# Altium schematic sheet 05 CAMERA, HDMI.SchDoc
size 513 x 386 mm
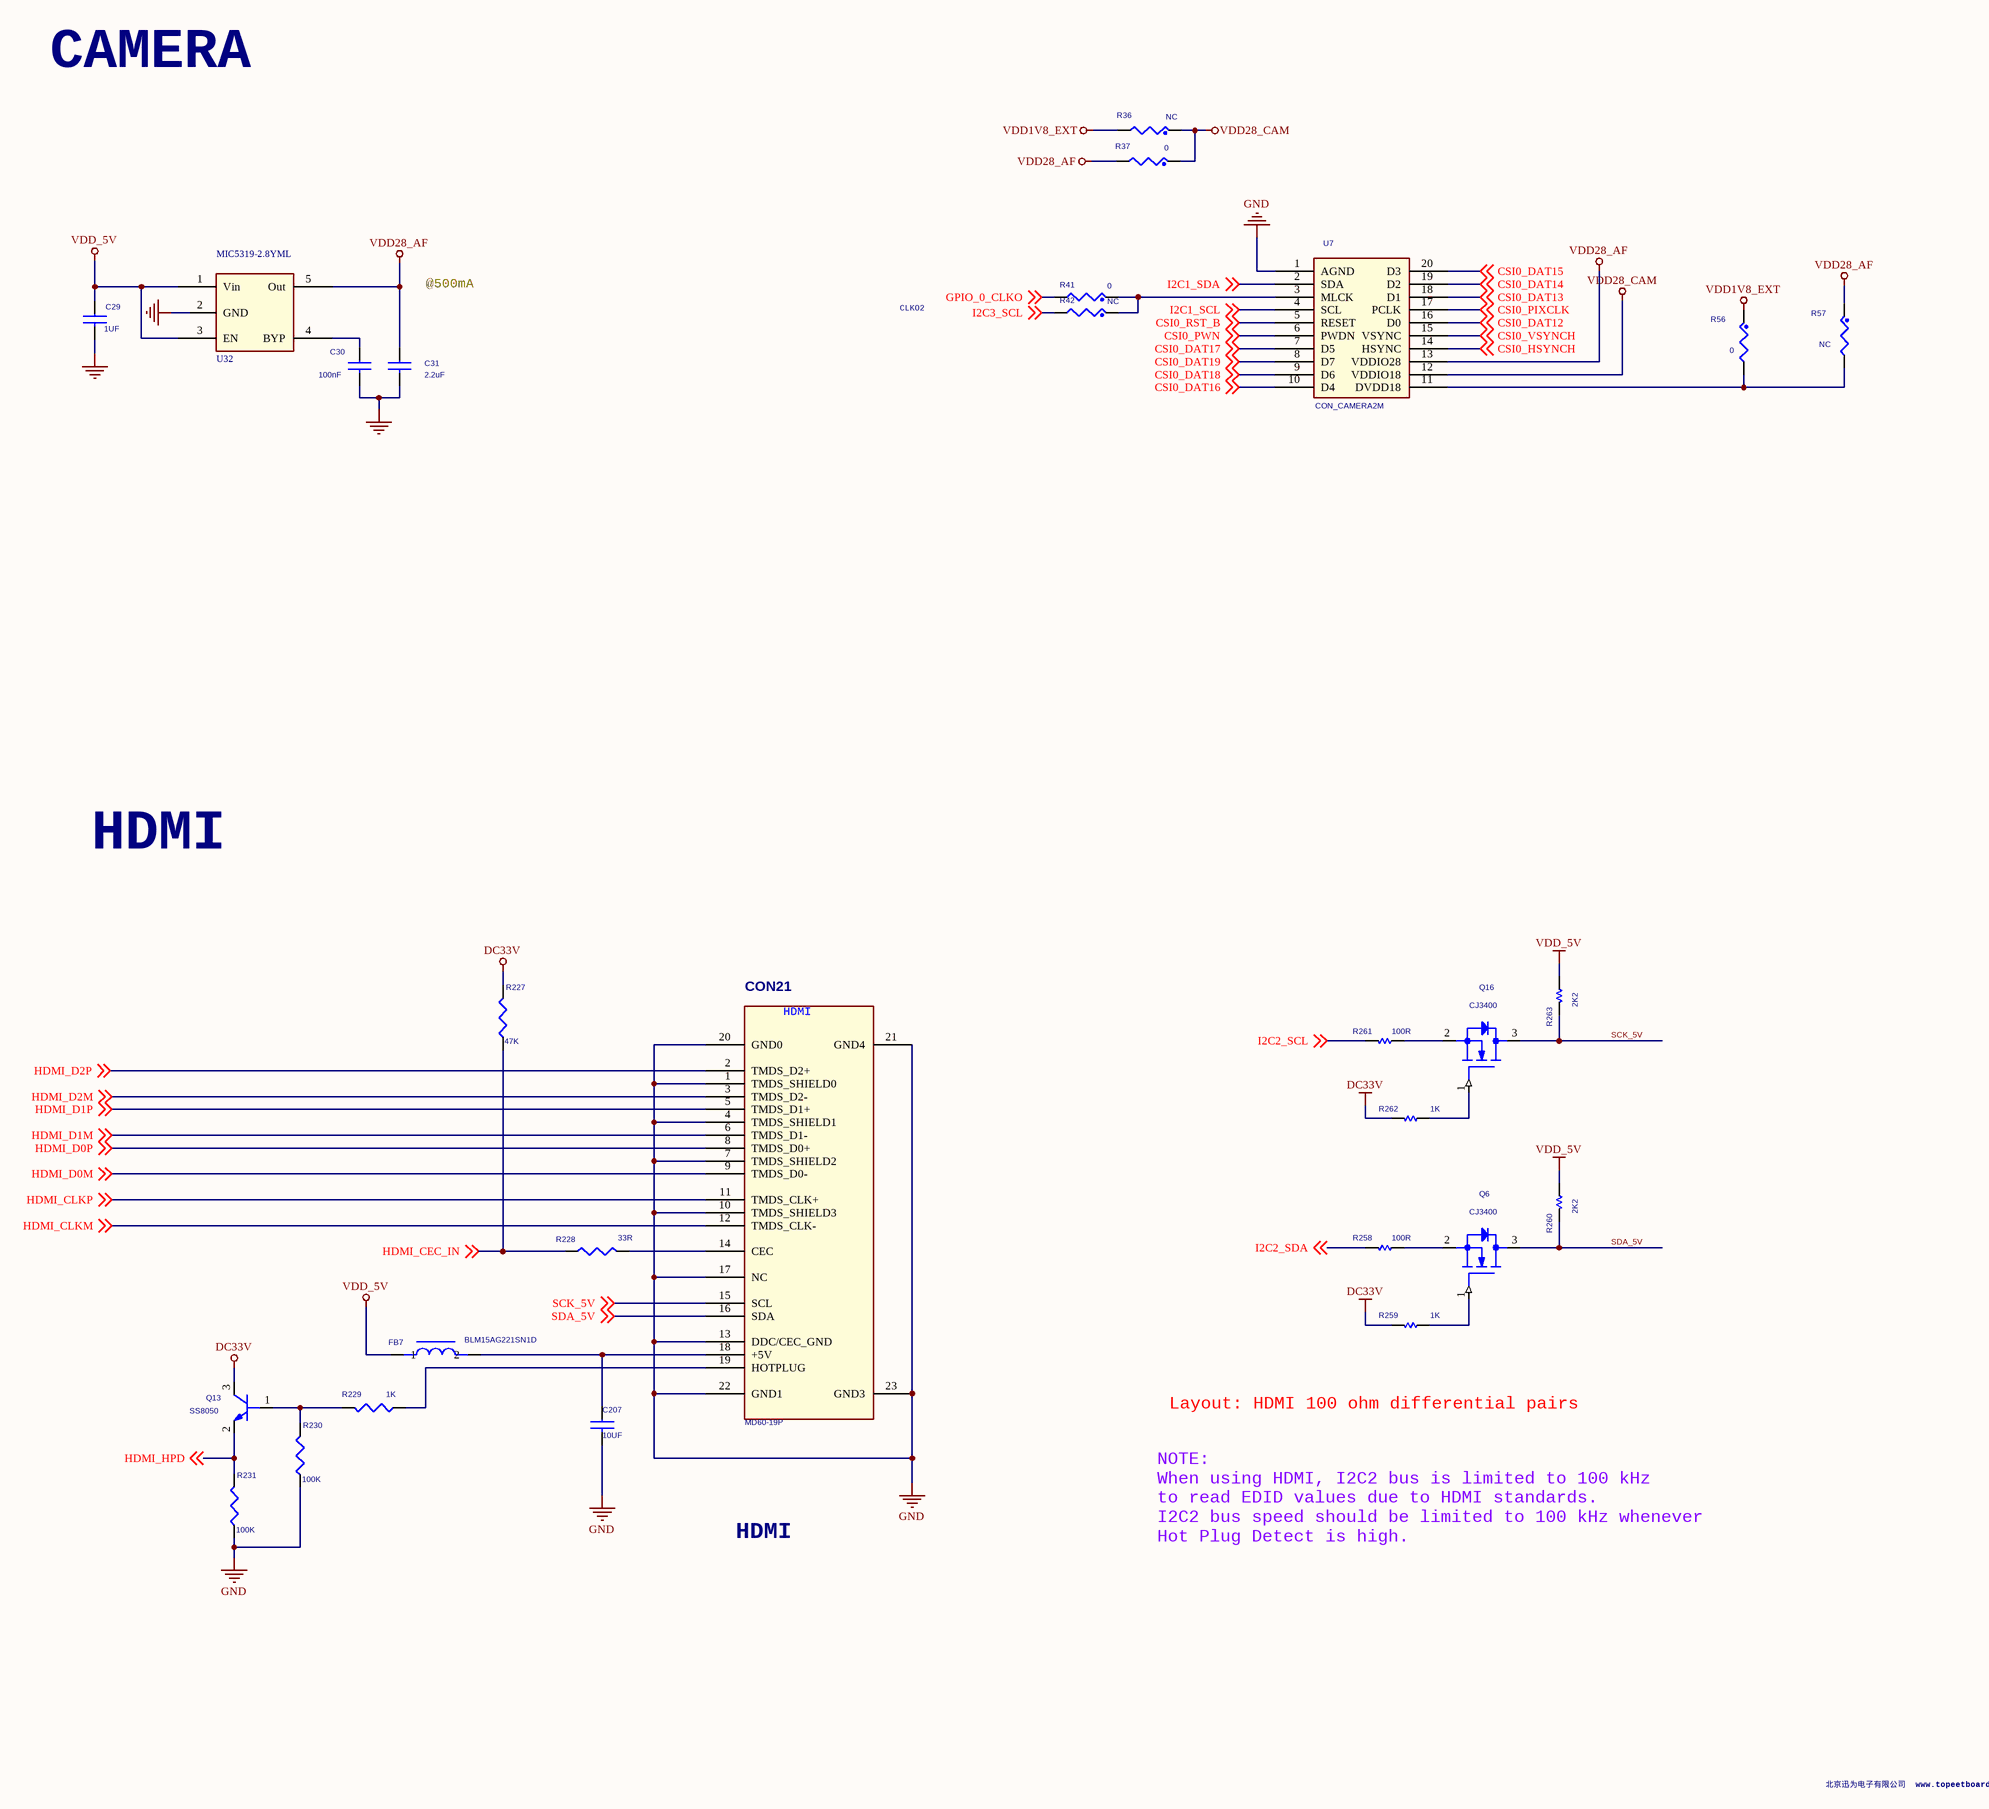
[diagram p0: 05 CAMERA, HDMI.SchDoc]

## Parts
C29  1UF  [C0603]
C30  100nF  [C0603]
C31  2.2uF  [C0603]
C207  10UF  [C1608]
CON21  MD60-19P  [MD60-19P]
FB7  BLM15AG221SN1D  [FB2012]
Q6  CJ3400  [SOT-23]
Q13  SS8050  [SOT-23]
Q16  CJ3400  [SOT-23]
R36  NC  [R0402]
R37  0  [R0402]
R41  0  [R0402]
R42  NC  [R0402]
R56  0  [R0402]
R57  NC  [R0402]
R227  47K  [R1005]
R228  33R  [R1005]
R229  1K  [R1005]
R230  100K  [R1005]
R231  100K  [R1005]
R258  100R  [R0402]
R259  1K  [R0402]
R260  2K2  [R0402]
R261  100R  [R0402]
R262  1K  [R0402]
R263  2K2  [R0402]
U7  CON_CAMERA2M  [HDRMS2MM-2X10]
U32  MIC5319-2.8YML  [SOT23-5]

## Nets
DC33V: Q13.3(COLLECTOR) R227.2 R259.2 R262.2
GND: C29.2 C30.2 C31.2 C207.2 CON21.1(TMDS_SHIELD0) CON21.4(TMDS_SHIELD1) CON21.7(TMDS_SHIELD2) CON21.10(TMDS_SHIELD3) CON21.13(DDC/CEC_GND) CON21.17(NC) CON21.20(GND0) CON21.21(GND4) CON21.22(GND1) CON21.23(GND3) R230.1 R231.1 U7.1(AGND) U32.2(GND)
VDD1V8_EXT: R36.2 R56.1
VDD28_AF: C31.1 R37.2 R57.1 U7.13(VDDIO28) U32.5(Out)
VDD28_CAM: R36.1 R37.1 U7.12(VDDIO18)
VDD_5V: C29.1 FB7.1 R260.1 R263.1 U32.1(Vin) U32.3(EN)
CSI0_DAT12: U7.16(D0) ; off-sheet CSI0_DAT12
CSI0_DAT13: U7.18(D1) ; off-sheet CSI0_DAT13
CSI0_DAT14: U7.19(D2) ; off-sheet CSI0_DAT14
CSI0_DAT15: U7.20(D3) ; off-sheet CSI0_DAT15
CSI0_DAT16: U7.10(D4) ; off-sheet CSI0_DAT16
CSI0_DAT17: U7.7(D5) ; off-sheet CSI0_DAT17
CSI0_DAT18: U7.9(D6) ; off-sheet CSI0_DAT18
CSI0_DAT19: U7.8(D7) ; off-sheet CSI0_DAT19
CSI0_HSYNCH: U7.14(HSYNC) ; off-sheet CSI0_HSYNCH
CSI0_PIXCLK: U7.17(PCLK) ; off-sheet CSI0_PIXCLK
CSI0_PWN: U7.6(PWDN) ; off-sheet CSI0_PWN
CSI0_RST_B: U7.5(RESET) ; off-sheet CSI0_RST_B
CSI0_VSYNCH: U7.15(VSYNC) ; off-sheet CSI0_VSYNCH
GPIO_0_CLKO: R41.2 ; off-sheet GPIO_0_CLKO
HDMI_CEC_IN: R227.1 R228.1 ; off-sheet HDMI_CEC_IN
HDMI_CLKM: CON21.12(TMDS_CLK-) ; off-sheet HDMI_CLKM
HDMI_CLKP: CON21.11(TMDS_CLK+) ; off-sheet HDMI_CLKP
HDMI_D0M: CON21.9(TMDS_D0-) ; off-sheet HDMI_D0M
HDMI_D0P: CON21.8(TMDS_D0+) ; off-sheet HDMI_D0P
HDMI_D1M: CON21.6(TMDS_D1-) ; off-sheet HDMI_D1M
HDMI_D1P: CON21.5(TMDS_D1+) ; off-sheet HDMI_D1P
HDMI_D2M: CON21.3(TMDS_D2-) ; off-sheet HDMI_D2M
HDMI_D2P: CON21.2(TMDS_D2+) ; off-sheet HDMI_D2P
HDMI_HPD: Q13.2(EMITTER) R231.2 ; off-sheet HDMI_HPD
I2C1_SCL: U7.4(SCL) ; off-sheet I2C1_SCL
I2C1_SDA: U7.2(SDA) ; off-sheet I2C1_SDA
I2C2_SCL: R261.2 ; off-sheet I2C2_SCL
I2C2_SDA: R258.2 ; off-sheet I2C2_SDA
I2C3_SCL: R42.2 ; off-sheet I2C3_SCL
SCK_5V: CON21.15(SCL) Q16.3(DRAIN) R263.2 ; off-sheet SCK_5V
SDA_5V: CON21.16(SDA) Q6.3(DRAIN) R260.2 ; off-sheet SDA_5V
NetC30_1: C30.1 U32.4(BYP)
NetC207_1: C207.1 CON21.18(+5V) FB7.2
NetCON21_14: CON21.14(CEC) R228.2
NetCON21_19: CON21.19(HOTPLUG) R229.1
NetQ6_1: Q6.1(GATE) R259.1
NetQ6_2: Q6.2(SOURCE) R258.1
NetQ13_1: Q13.1(BASE) R229.2 R230.2
NetQ16_1: Q16.1(GATE) R262.1
NetQ16_2: Q16.2(SOURCE) R261.1
NetR41_1: R41.1 R42.1 U7.3(MLCK)
NetR56_2: R56.2 R57.2 U7.11(DVDD18)

## Notes on the sheet
- CAMERA
- @500mA
- CLKO2
- HDMI
- Layout: HDMI 100 ohm differential pairs
- NOTE:
  When using HDMI, I2C2 bus is limited to 100 kHz
  to read EDID values due to HDMI standards.
  I2C2 bus speed should be limited to 100 kHz whenever
  Hot Plug Detect is high.
- 北京迅为电子有限公司  www.topeetboard.com
- (in symbol MD60-19P_4) HDMI

## Library data of the parts
C29-C31 = C0603_0
C207 = C1608_Dup1
CON21 = MD60-19P_4
FB7 = HCB2012KF-300T50_1
Q6 Q16 = NDS351N/SOT_0
Q13 = L14P2/TO_1
R36 R37 R42 = RES_Dup1: RES MF 33 OHM 1/16W 5% 0402; AGILE_PN: 470-75634; TOL: 1%; MFG_NAME01: SMEC; MFG_PN01: RC73L2Z330JTF; CAD_APPROVED: Yes; FPLIST: RC0402_25,RC0402_HD,0402_CC; SIGNAL_MODEL: DEFAULT_RESISTOR_33OHM_2_1; ROHS: Yes; HEIGHT: 0.55 mm; Tolerance: 5%
R41 R56 R57 = RES_Dup1: RES MF 33 OHM 1/16W 5% 0402; SIGNAL_MODEL: DEFAULT_RESISTOR_33OHM_2_1; FPLIST: RC0402_25,RC0402_HD,0402_CC; CAD_APPROVED: Yes; MFG_PN01: RC73L2Z330JTF; MFG_NAME01: SMEC; TOL: 1%; AGILE_PN: 470-75634; Tolerance: 5%; HEIGHT: 0.55 mm; ROHS: Yes
R227-R231 = R1005_0_Dup2
R258-R263 = SMALL R1
U7 = CON20_0
U32 = MP1541_0